# EAGLE schematic converter adapter (EAGLE 6.4)
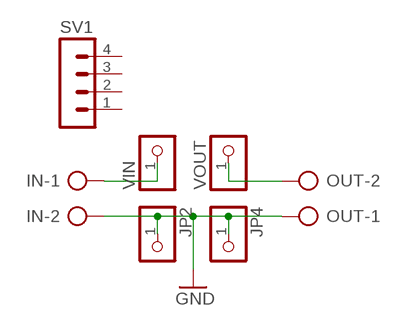
[diagram p0: schematic, sheet 1]

## Parts
IN  AK500/2-H  [AK500/2-H]
JP2  PINHD-1X1  [1X01]
JP4  PINHD-1X1  [1X01]
OUT  AK500/2-H  [AK500/2-H]
SV1  MA04-1  [MA04-1]
VIN  PINHD-1X1  [1X01]
VOUT  PINHD-1X1  [1X01]

## Nets
GND: IN.2 JP2.1 JP4.1 OUT.1
N$1: OUT.2 VOUT.1
N$4: IN.1 VIN.1
Unconnected: SV1.1 SV1.2 SV1.3 SV1.4

## Library data of the parts
IN OUT = con-ptr500:AK500/2-H: CONNECTOR Aug. 2004 / PTR Meßtechnik: Die Bezeichnung der Serie AK505 wurde geändert. Es handelt sich hierbei um AK500 in horizontaler Ausführung.; OC_FARNELL: unknown; OC_NEWARK: unknown
JP2 JP4 VIN VOUT = pinhead:PINHD-1X1: PIN HEADER
SV1 = con-lstb:MA04-1: PIN HEADER; OC_FARNELL: unknown; OC_NEWARK: unknown